# EAGLE schematic Motor (EAGLE 9.7.0)

## Sheet 1 of 2
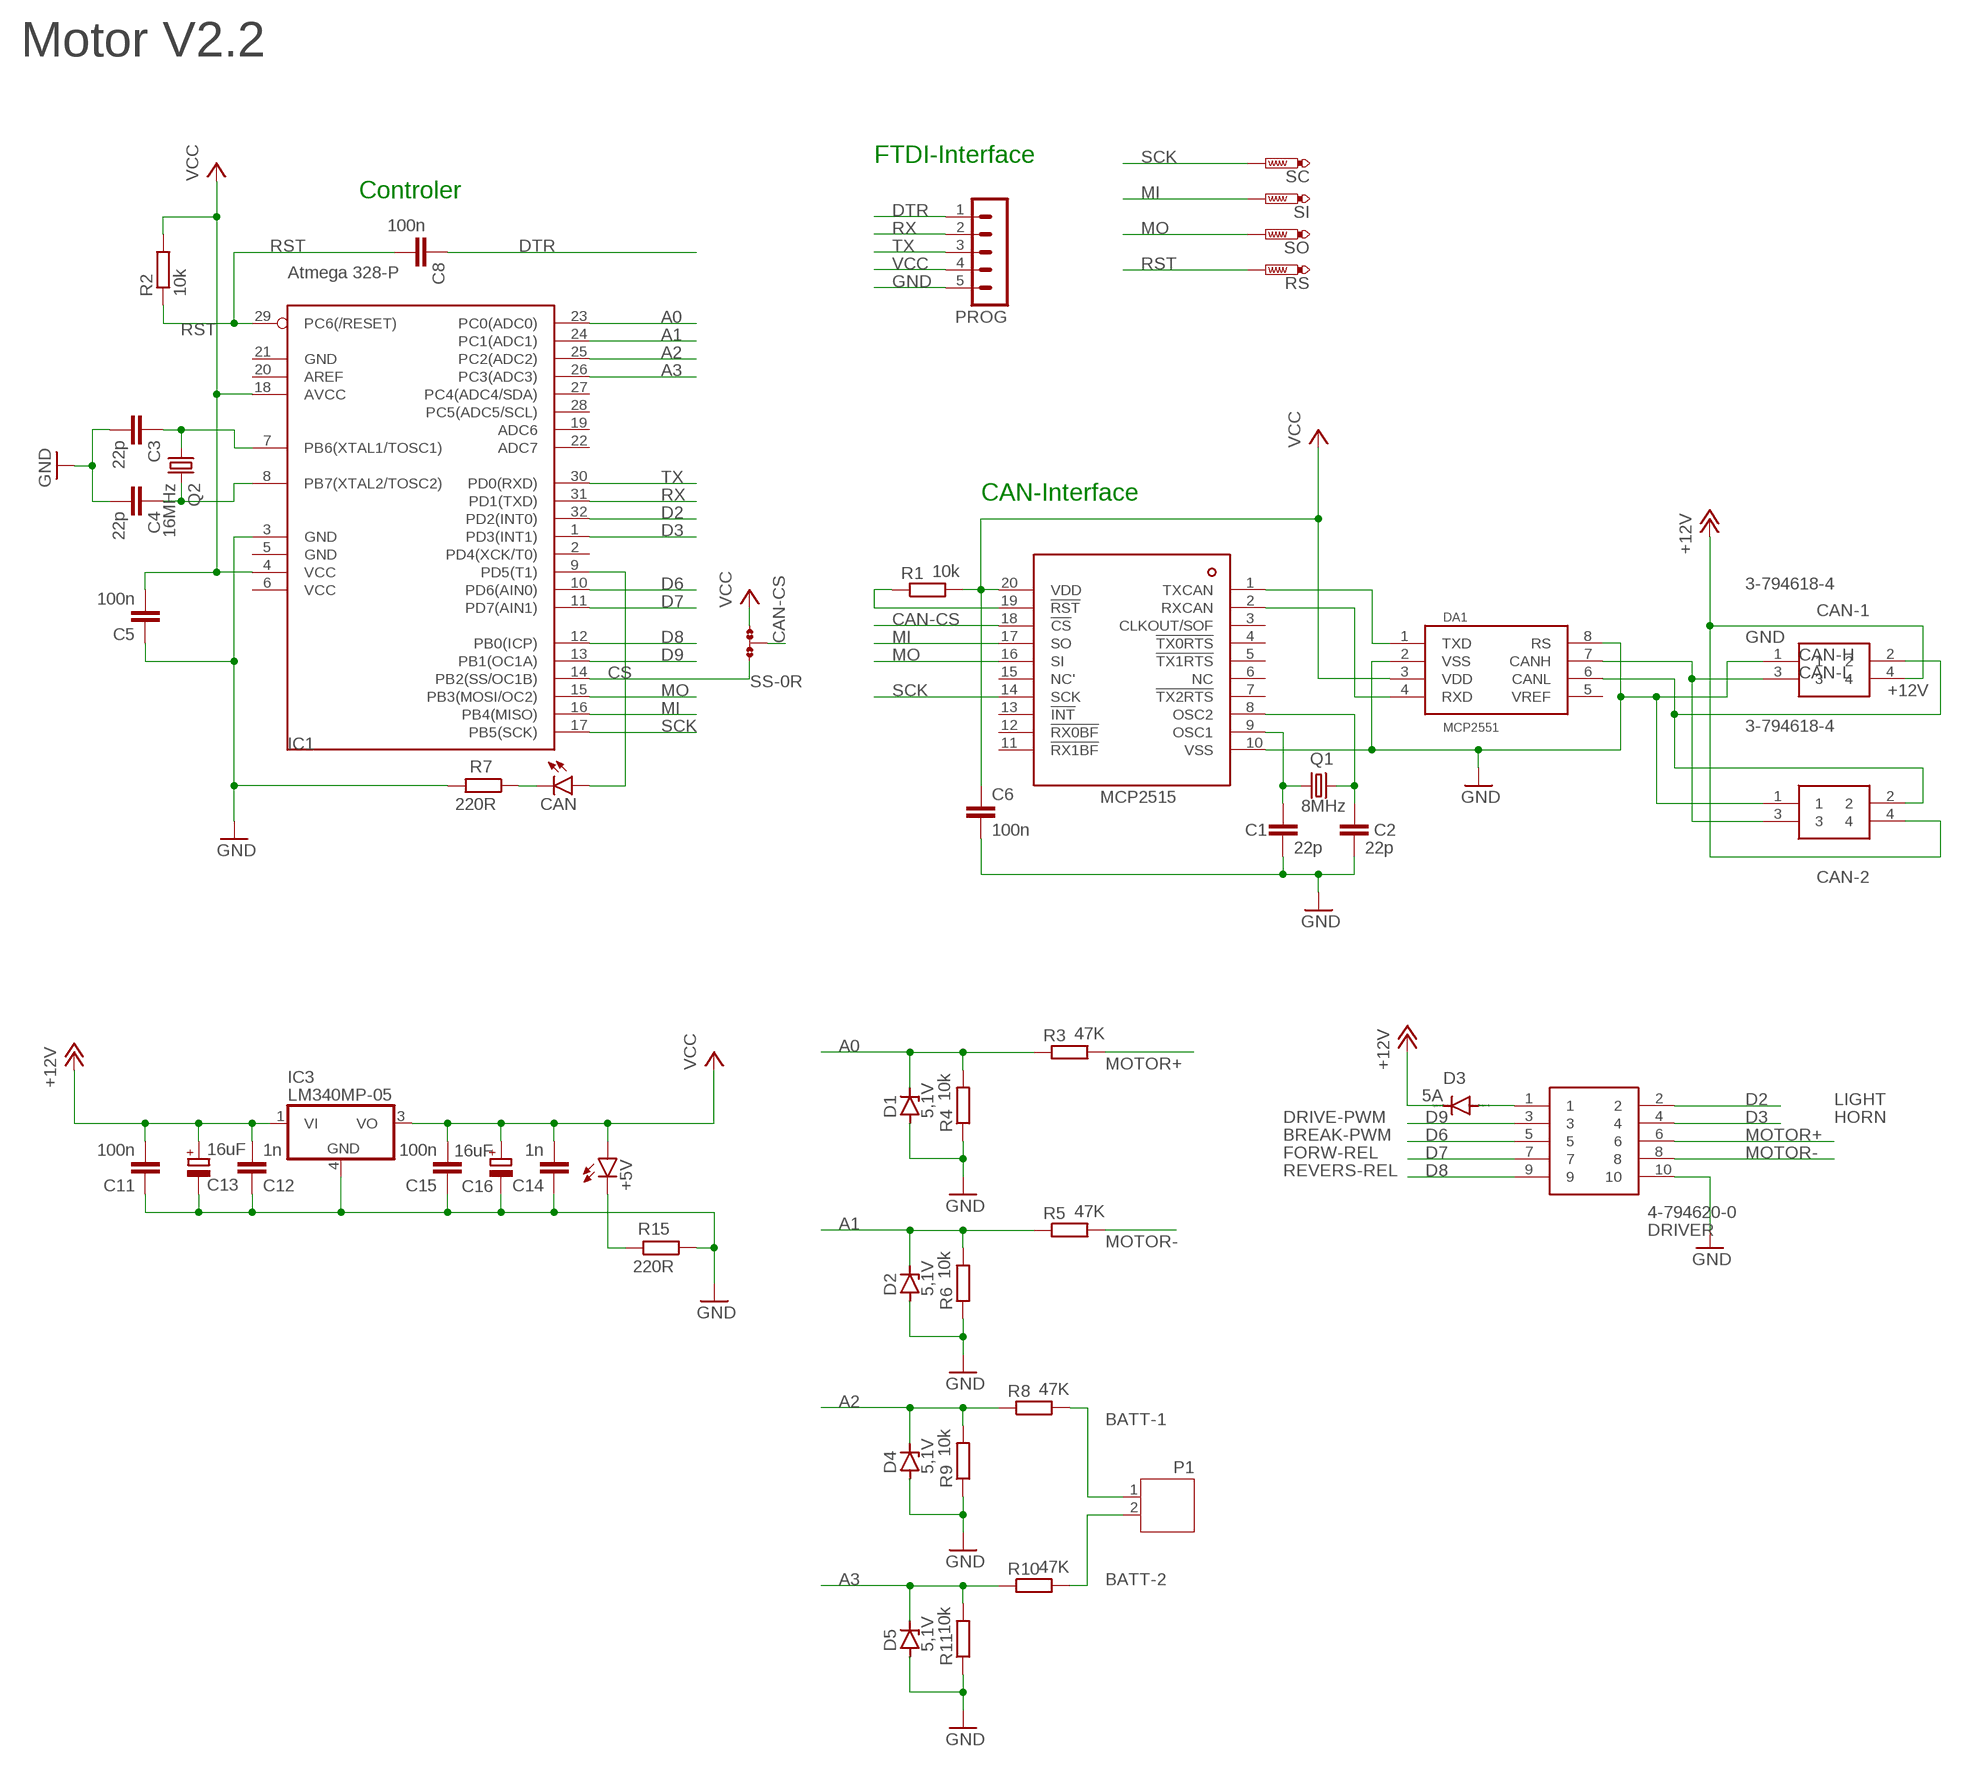
[diagram p0: schematic, sheet 1]

### Parts
+5V  LEDCHIP-LED0603  [CHIP-LED0603]
C1  22p  C-EUC0402K  [C0402K]
C2  22p  C-EUC0402K  [C0402K]
C3  22p  C-EUC0402K  [C0402K]
C4  22p  C-EUC0402K  [C0402K]
C5  100n  C-EUC0402K  [C0402K]
C6  100n  C-EUC0402K  [C0402K]
C8  100n  C-EUC0402K  [C0402K]
C11  100n  C-EUC0402K  [C0402K]
C12  1n  C-EUC0402K  [C0402K]
C13  16uF  CPOL-EUA/3216-18W  [A/3216-18W]
C14  1n  C-EUC0402K  [C0402K]
C15  100n  C-EUC0402K  [C0402K]
C16  16uF  CPOL-EUA/3216-18W  [A/3216-18W]
CAN  LEDCHIP-LED0603  [CHIP-LED0603]
CAN-1  3-794618-4  [SHDRRA4W102P300_2X2_686X892X73]
CAN-2  3-794618-4  [SHDRRA4W102P300_2X2_686X892X73]
D1  5,1V  ZENER-DIODESOD80C  [SOD80C]
D2  5,1V  ZENER-DIODESOD80C  [SOD80C]
D3  5A  DIODE-DO214AA  [DO214AA]
D4  5,1V  ZENER-DIODESOD80C  [SOD80C]
D5  5,1V  ZENER-DIODESOD80C  [SOD80C]
DA1  MCP2551  TJA1050  [SO08]
DRIVER  4-794620-0  [47946200]
IC1  Atmega 328-P  MEGA8-AI  [TQFP32-08]
IC2  MCP2515  [TSSOP20]
IC3  LM340MP-05  [SOT223]
P1  JST-PH2  [JST-PH2]
PROG  MA05-1  [MA05-1]
Q1  8MHz  CRYSTALHC49S  [HC49/S]
Q2  16MHz  CRYSTALHC49S  [HC49/S]
R1  10k  R-EU_R0805  [R0805]
R2  10k  R-EU_R0805  [R0805]
R3  47K  R-EU_MELF0102W  [MINI_MELF-0102W]
R4  10k  R-EU_MELF0102W  [MINI_MELF-0102W]
R5  47K  R-EU_MELF0102W  [MINI_MELF-0102W]
R6  10k  R-EU_MELF0102W  [MINI_MELF-0102W]
R7  220R  R-EU_R0805  [R0805]
R8  47K  R-EU_MELF0102W  [MINI_MELF-0102W]
R9  10k  R-EU_MELF0102W  [MINI_MELF-0102W]
R10  47K  R-EU_MELF0102W  [MINI_MELF-0102W]
R11  10k  R-EU_MELF0102W  [MINI_MELF-0102W]
R15  220R  R-EU_R0805  [R0805]
RS  PTR1B1,27  [B1,27]
SC  PTR1B1,27  [B1,27]
SI  PTR1B1,27  [B1,27]
SO  PTR1B1,27  [B1,27]
SS  0R-JUMPA  [A0R-JMP]

### Nets
+12V: C11.2 C12.2 C13.+ CAN-1.4 CAN-2.4 D3.C IC3.1(VI)
A0: D1.C IC1.23(PC0(ADC0)) R3.1 R4.2
A1: D2.C IC1.24(PC1(ADC1)) R5.1 R6.2
A2: D4.C IC1.25(PC2(ADC2)) R8.1 R9.2
A3: D5.C IC1.26(PC3(ADC3)) R10.1 R11.2
BATT-1: P1.1 R8.2
BATT-2: P1.2 R10.2
CAN-CS: IC2.18(!CS) SS.2
CAN-H: CAN-1.3 CAN-2.3 DA1.7(CANH)
CAN-L: CAN-1.2 CAN-2.2 DA1.6(CANL)
CAN-OCC1: C1.1 IC2.9(OSC1) Q1.1
CAN-OCC2: C2.1 IC2.8(OSC2) Q1.2
CS: IC1.14(PB2(SS/OC1B)) SS.3
D2: DRIVER.2 IC1.32(PD2(INT0))
D3: DRIVER.4 IC1.1(PD3(INT1))
D6: DRIVER.5 IC1.10(PD6(AIN0))
D7: DRIVER.7 IC1.11(PD7(AIN1))
D8: DRIVER.9 IC1.12(PB0(ICP))
D9: DRIVER.3 IC1.13(PB1(OC1A))
DTR: C8.1 PROG.1
GND: C1.2 C2.2 C3.2 C4.2 C5.1 C6.2 C11.1 C12.1 C13.- C14.1 C15.1 C16.- CAN-1.1 CAN-2.1 D1.A D2.A D4.A D5.A DA1.2(VSS) DA1.8(RS) DRIVER.10 IC1.3(GND) IC2.10(VSS) IC3.4(GND) PROG.5 R4.1 R6.1 R7.2 R9.1 R11.1 R15.1
MI: IC1.16(PB4(MISO)) IC2.17(SO) SI.TP
MO: IC1.15(PB3(MOSI/OC2)) IC2.16(SI) SO.TP
MOTOR+: DRIVER.6 R3.2
MOTOR-: DRIVER.8 R5.2
N$1: D3.A DRIVER.1
N$2: CAN.C R7.1
N$3: CAN.A IC1.9(PD5(T1))
N$6: IC2.19(!RST) R1.1
N$10: C3.1 IC1.7(PB6(XTAL1/TOSC1)) Q2.1
N$11: C4.1 IC1.8(PB7(XTAL2/TOSC2)) Q2.2
N$12: +5V.C R15.2
RST: C8.2 IC1.29(PC6(/RESET)) R2.1 RS.TP
RX: IC1.31(PD1(TXD)) PROG.2
RXCAN: DA1.4(RXD) IC2.2(RXCAN)
SCK: IC1.17(PB5(SCK)) IC2.14(SCK) SC.TP
TX: IC1.30(PD0(RXD)) PROG.3
TXCAN: DA1.1(TXD) IC2.1(TXCAN)
VCC: +5V.A C5.2 C6.1 C14.2 C15.2 C16.+ DA1.3(VDD) IC1.4(VCC) IC1.18(AVCC) IC2.20(VDD) IC3.3(VO) PROG.4 R1.2 R2.2 SS.1
Unconnected: DA1.5(VREF) IC1.2(PD4(XCK/T0)) IC1.19(ADC6) IC1.20(AREF) IC1.22(ADC7) IC1.27(PC4(ADC4/SDA)) IC1.28(PC5(ADC5/SCL)) IC2.3(CLKOUT/SOF) IC2.4(!TX0RTS) IC2.5(!TX1RTS) IC2.6(NC) IC2.7(!TX2RTS) IC2.11(!RX1BF) IC2.12(!RX0BF) IC2.13(!INT) IC2.15(NC')

### Notes on the sheet
- Motor V2.2
- FTDI-Interface
- Controler
- CAN-Interface
- LIGHT
- DRIVE-PWM | HORN
- BREAK-PWM
- FORW-REL
- REVERS-REL

## Sheet 2 of 2

## Power pins joined to a net without a drawn wire
GND: IC1.5(GND) IC1.21(GND)
VCC: IC1.6(VCC)

## Library data of the parts
+5V CAN = led:LED: LED OSRAM: - CHIPLED LG R971, LG N971, LY N971, LG Q971, LY Q971, LO R971, LY R971 LH N974, LH R974 LS Q976, LO Q976, LY Q976 LO Q996 - Hyper CHIPLED LW Q18S LB Q993, LB Q99A, LB R99A - SideLED LS A670, LO A670, LY A670, LG A670, LP A670 LB A673, LV A673, LT A673, LW A673 LH A674 LY A675 LS A676, LA A676, LO A676, LY A676, LW A676 LS A679, LY A679, LG A679 - Hyper Micro SIDELED® LS Y876, LA Y876, LO Y876, LY Y876 LT Y87S - SmartLED LW L88C, LW L88S LB L89C, LB L89S, LG L890 LS L89K, LO L89K, LY L89K LS L896, LA L896, LO L896, LY L896 - TOPLED LS T670, LO T670, LY T670, LG T670, LP T670 LSG T670, LSP T670, LSY T670, LOP T670, LYG T670 LG T671, LOG T671, LSG T671 LB T673, LV T673, LT T673, LW T673 LH T674 LS T676, LA T676, LO T676, LY T676, LB T676, LH T676, LSB T676, LW T676 LB T67C, LV T67C, LT T67C, LS T67K, LO T67K, LY T67K, LW E67C LS E67B, LA E67B, LO E67B, LY E67B, LB E67C, LV E67C, LT E67C LW T67C LS T679, LY T679, LG T679 LS T770, LO T770, LY T770, LG T770, LP T770 LB T773, LV T773, LT T773, LW T773 LH T774 LS E675, LA E675, LY E675, LS T675 LS T776, LA T776, LO T776, LY T776, LB T776 LHGB T686 LT T68C, LB T68C - Hyper Mini TOPLED® LB M676 - Mini TOPLED Santana® LG M470 LS M47K, LO M47K, LY M47K Source: http://www.osram.convergy.de LUXEON: - LUMILED® LXK2-PW12-R00, LXK2-PW12-S00, LXK2-PW14-U00, LXK2-PW14-V00 LXK2-PM12-R00, LXK2-PM12-S00, LXK2-PM14-U00 LXK2-PE12-Q00, LXK2-PE12-R00, LXK2-PE12-S00, LXK2-PE14-T00, LXK2-PE14-U00 LXK2-PB12-K00, LXK2-PB12-L00, LXK2-PB12-M00, LXK2-PB14-N00, LXK2-PB14-P00, LXK2-PB14-Q00 LXK2-PR12-L00, LXK2-PR12-M00, LXK2-PR14-Q00, LXK2-PR14-R00 LXK2-PD12-Q00, LXK2-PD12-R00, LXK2-PD12-S00 LXK2-PH12-R00, LXK2-PH12-S00 LXK2-PL12-P00, LXK2-PL12-Q00, LXK2-PL12-R00 Source: www.luxeon.com KINGBRIGHT: KA-3528ASYC Source: www.kingbright.com
C1-C6 C8 C11 C12 C14 C15 = rcl:C-EU: CAPACITOR, European symbol; SPICEPREFIX: C
C13 C16 = rcl:CPOL-EU: POLARIZED CAPACITOR, European symbol; SPICEPREFIX: C
CAN-1 CAN-2 = SamacSys_Parts:3-794618-4: 4 way 2 row r/a header Mate-N-Lok Source: Datasheet <https://rs.componentsearchengine.com/Datasheets/2/3-794618-4.pdf>; DESCRIPTION: 4 way 2 row r/a header Mate-N-Lok; HEIGHT: 7.37mm; MANUFACTURER_NAME: TE Connectivity; MANUFACTURER_PART_NUMBER: 3-794618-4
D1 D2 D4 D5 = diode:ZENER-DIODE: Z-Diode
D3 = diode:DIODE-: DIODE
DA1 = TJA1050:TJA1050: High speed CAN transceiver Input levels compatible with 3.3 V and 5 V devices 5V supply
DRIVER = 4-794620-0:4-794620-0: Pin & Socket Connectors HDR R/A 10 POS 30 AU DUAL Source: Datasheet <https://media.digikey.com/pdf/Data Sheets/Tyco Electonics AMP PDFs/794620.pdf>; ARROW_PART_NUMBER: 4-794620-0; ARROW_PRICE-STOCK: https://www.arrow.com/en/products/4-794620-0/te-connectivity; DESCRIPTION: Pin & Socket Connectors HDR R/A 10 POS 30 AU DUAL; HEIGHT: 10.88mm; MANUFACTURER_NAME: TE Connectivity; MANUFACTURER_PART_NUMBER: 4-794620-0; MOUSER_PART_NUMBER: 571-4-794620-0; MOUSER_PRICE-STOCK: https://www.mouser.co.uk/ProductDetail/TE-Connectivity-AMP/4-794620-0?qs=Rd%252BN518myCzN0bYIsEmaSQ%3D%3D
IC1 = atmel:MEGA8: MICROCONTROLLER 8 Kbytes FLASH, 1 kbytes SRAM, 512 bytes EEPROM, USART, 6-channel 10 bit ADC, 2-channel 8 bit ADC Pin compatible with Atmega48, ATMega88, ATMega168 Source: avr.lbr; MPN: ATMEGA8-16AU; OC_FARNELL: 9171371; OC_NEWARK: 73M8863
IC2 = mcp2514:MCP2515: Microchip Technology’s MCP2515 is a stand-alone Controller Area Network (CAN) controller that implements the CAN specification, version 2.0B. It is capable of transmitting and receiving both standard and extended data and remote frames. The MCP2515 has two acceptance masks and six acceptance filters that are used to filter out unwanted messages, thereby reducing the host MCUs overhead. The MCP2515 interfaces with microcontrollers (MCUs) via an industry standard Serial Peripheral Interface (SPI).
IC3 = linear:LM340?-*: Positive VOLTAGE REGULATOR Source: http://cache.national.com/ds/LM/LM340.pdf
P1 = jst-ph:JST-PH2
PROG = con-lstb:MA05-1: PIN HEADER; OC_FARNELL: unknown; OC_NEWARK: unknown
Q1 Q2 = crystal:CRYSTAL: CRYSTAL; OC_FARNELL: 1667008; OC_NEWARK: unknown
R1-R11 R15 = rcl:R-EU_: RESISTOR, European symbol; SPICEPREFIX: R
RS SC SI SO = testpad:PTR1: TEST PIN
SS = jump-0r-smd:0R-JUMP: SMD 0R 0805 Jumper